# Altium schematic sheet Sheet2.SchDoc
size A4; SheetNumber: 1; SheetTotal: 1
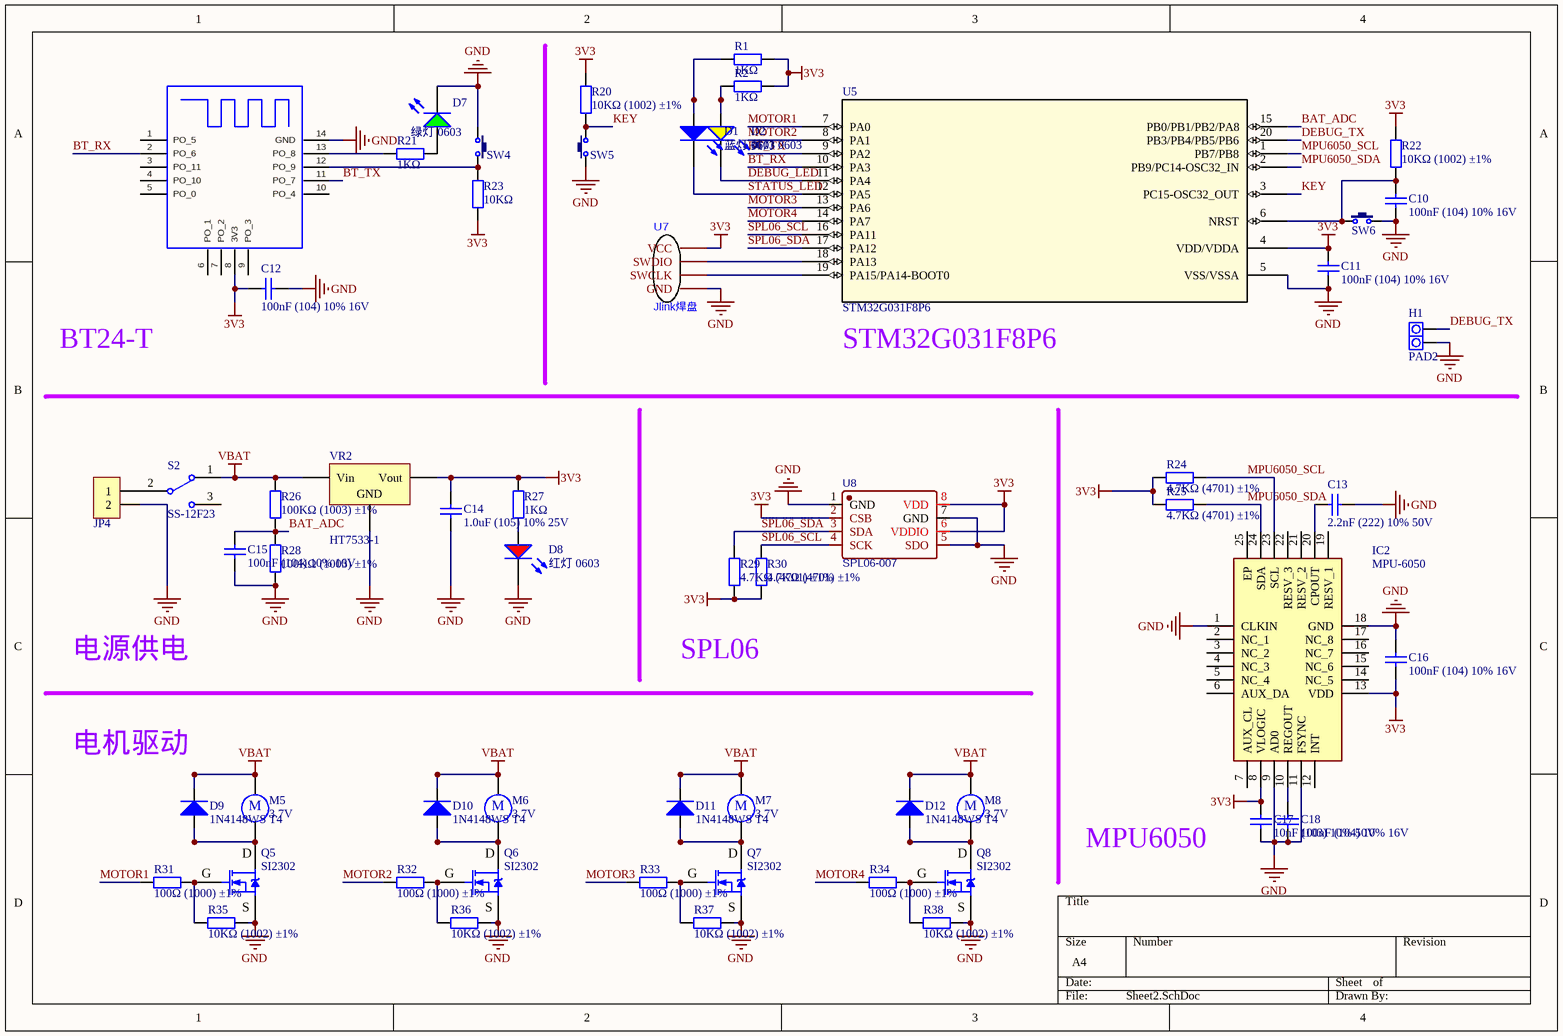
[diagram p0: Sheet2.SchDoc]

## Parts
C10  100nF (104) 10% 16V  [0402_C]
C11  100nF (104) 10% 16V  [0402_C]
C12  100nF (104) 10% 16V  [0402_C]
C13  2.2nF (222) 10% 50V  [0402_C]
C14  1.0uF (105) 10% 25V  [0402_C]
C15  100nF (104) 10% 16V  [0402_C]
C16  100nF (104) 10% 16V  [0402_C]
C17  10nF (103) 10% 50V  [0402_C]
C18  100nF (104) 10% 16V  [0402_C]
D1  蓝灯 0603  [0603_LED_S1]
D2  黄灯 0603  [0603_LED_S1]
D7  绿灯 0603  [0603_LED_S1]
D8  红灯 0603  [0603_LED_S1]
D9  1N4148WS T4  [SOD-323]
D10  1N4148WS T4  [SOD-323]
D11  1N4148WS T4  [SOD-323]
D12  1N4148WS T4  [SOD-323]
H1  PAD2  [PAD2-2.54]
IC2  MPU-6050  [MPU6050]
JP4  HDR-1X2  [ZH1.5-WI-2P]  (value not drawn)
M5  3.7V  [MX 1.25-WI-2P]
M6  3.7V  [MX 1.25-WI-2P]
M7  3.7V  [MX 1.25-WI-2P]
M8  3.7V  [MX 1.25-WI-2P]
Q5  SI2302  [SOT23-3N]
Q6  SI2302  [SOT23-3N]
Q7  SI2302  [SOT23-3N]
Q8  SI2302  [SOT23-3N]
R1  1KΩ  [0402_R]
R2  1KΩ  [0402_R]
R20  10KΩ (1002) ±1%  [0402_R]
R21  1KΩ  [0402_R]
R22  10KΩ (1002) ±1%  [0402_R]
R23  10KΩ  [0402_R]
R24  4.7KΩ (4701) ±1%  [0402_R]
R25  4.7KΩ (4701) ±1%  [0402_R]
R26  100KΩ (1003) ±1%  [0402_R]
R27  1KΩ  [0402_R]
R28  100KΩ (1003) ±1%  [0402_R]
R29  4.7KΩ (4701) ±1%  [0402_R]
R30  4.7KΩ (4701) ±1%  [0402_R]
R31  100Ω (1000) ±1%  [0402_R]
R32  100Ω (1000) ±1%  [0402_R]
R33  100Ω (1000) ±1%  [0402_R]
R34  100Ω (1000) ±1%  [0402_R]
R35  10KΩ (1002) ±1%  [0402_R]
R36  10KΩ (1002) ±1%  [0402_R]
R37  10KΩ (1002) ±1%  [0402_R]
R38  10KΩ (1002) ±1%  [0402_R]
S2  SS-12F23  [MSK-12C01-07]
SW4  3x6x5  [SW-SMD_4P-L5.1-W5.1-P3.70-LS6.5-TL-2]  (value not drawn)
SW5  3x6x5  [SW-SMD_4P-L5.1-W5.1-P3.70-LS6.5-TL-2]  (value not drawn)
SW6  3x6x5  [SW-SMD_4P-L5.1-W5.1-P3.70-LS6.5-TL-2]  (value not drawn)
U5  STM32G031F8P6  [TSSOP20]
U6  BT24T  [CC2640T]  (value not drawn)
U7  Jlink焊盘  [PCBComponent_1 - duplicate]
U8  SPL06-007  [SENSOR-SMD_SPL06-007]
VR2  HT7533-1  [SOT-89(SOT-89-3)]

## Nets
3V3: C11.1 C12.2 C14.2 C16.1 C17.2 IC2.8(VLOGIC) IC2.13(VDD) R1.2 R2.1 R20.2 R22.1 R23.2 R24.1 R25.1 R27.2 R29.1 R30.1 U5.4(VDD/VDDA) U6.8(3V3) U7.1(VCC) U8.2(CSB) U8.6(VDDIO) U8.8(VDD) VR2.3(Vout)
GND: C10.2 C11.2 C12.1 C13.2 C14.1 C15.1 C16.2 C17.1 C18.1 D7.K D8.K H1.1 IC2.1(CLKIN) IC2.9(AD0) IC2.11(FSYNC) IC2.18(GND) JP4.2 Q5.2(S) Q6.2(S) Q7.2(S) Q8.2(S) R28.1 R35.2 R36.2 R37.2 R38.2 SW4.1 SW5.1 SW6.2 U5.5(VSS/VSSA) U6.14(GND) U7.4(GND) U8.1(GND) U8.5(SDO) U8.7(GND) VR2.1(GND)
VBAT: D9.2(K) D10.2(K) D11.2(K) D12.2(K) M5.1 M6.1 M7.1 M8.1 R26.2 S2.1 VR2.2(Vin)
BAT_ADC: C15.2 R26.1 R28.2 U5.15(PB0/PB1/PB2/PA8)
BT_RX: U5.10(PA3) U6.2(PO_6)
BT_TX: U5.9(PA2) U6.11(PO_7)
DEBUG_LED: D2.K U5.11(PA4)
DEBUG_TX: H1.2 U5.20(PB3/PB4/PB5/PB6)
KEY: R20.1 SW5.2 U5.3(PC15-OSC32_OUT)
MOTOR1: R31.1 U5.7(PA0)
MOTOR2: R32.1 U5.8(PA1)
MOTOR3: R33.1 U5.13(PA6)
MOTOR4: R34.1 U5.14(PA7)
MPU6050_SCL: IC2.23(SCL) R24.2 U5.1(PB7/PB8)
MPU6050_SDA: IC2.24(SDA) R25.2 U5.2(PB9/PC14-OSC32_IN)
SPL06_SCL: R30.2 U5.16(PA11) U8.4(SCK)
SPL06_SDA: R29.2 U5.17(PA12) U8.3(SDA)
STATUS_LED: D1.K U5.12(PA5)
NetC10_1: C10.1 R22.2 SW6.1 U5.6(NRST)
NetC13_1: C13.1 IC2.20(CPOUT)
NetC18_2: C18.2 IC2.10(REGOUT)
NetD1_A: D1.A R1.1
NetD2_A: D2.A R2.2
NetD7_A: D7.A R21.2
NetD8_A: D8.A R27.1
NetD9_1: D9.1(A) M5.2 Q5.3(D)
NetD10_1: D10.1(A) M6.2 Q6.3(D)
NetD11_1: D11.1(A) M7.2 Q7.3(D)
NetD12_1: D12.1(A) M8.2 Q8.3(D)
NetJP4_1: JP4.1 S2.2
NetQ5_1: Q5.1(G) R31.2 R35.1
NetQ6_1: Q6.1(G) R32.2 R36.1
NetQ7_1: Q7.1(G) R33.2 R37.1
NetQ8_1: Q8.1(G) R34.2 R38.1
NetR21_1: R21.1 U6.13(PO_8)
NetR23_1: R23.1 SW4.2 U6.12(PO_9)
NetU5_18: U5.18(PA13) U7.2(SWDIO)
NetU5_19: U5.19(PA15/PA14-BOOT0) U7.3(SWCLK)

Not connected (* = marked no-connect by the designer): IC2 2(NC_1) 3(NC_2) 4(NC_3) 5(NC_4) 6(AUX_DA) 7(AUX_CL) 12(INT) 14(NC_5) 15(NC_6) 16(NC_7) 17(NC_8) 19(RESV_1) 21(RESV_2) 22(RESV_3) 25(EP); S2 3; U6 1(PO_5) 3(PO_11) 4(PO_10) 5(PO_0) 6(PO_1) 7(PO_2) 9(PO_3) 10(PO_4)

## Notes on the sheet
- BT24-T
- (near U5) STM32G031F8P6
- 电源供电
- SPL06
- 电机驱动
- MPU6050
- (in symbol MOTOR) M

## Library data of the parts
C10-C12 C15 C16 C18 = 0402 100nF (104) 10% 16V: 贴片电容; ComponentLink1Description: 供应商链接; ComponentLink1URL: http://www.szlcsc.com/product/details_1877.html; Package: 0402; Supplier: LC; SuppliersPartNumber: C1525
C13 = 0402 2.2nF (222) 10% 50V: 贴片电容; ComponentLink1Description: 供应商链接; ComponentLink1URL: http://www.szlcsc.com/product/details_1883.html; Package: 0402; Supplier: LC; SuppliersPartNumber: C1531
C14 = 0402 1.0uF (105) 10% 25V: 贴片电容; ComponentLink1Description: 供应商链接; ComponentLink1URL: http://www.szlcsc.com/product/details_53938.html; Package: 0402; Supplier: LC; SuppliersPartNumber: C52923
C17 = 0402 10nF (103) 10% 50V: 贴片电容; ComponentLink1Description: 供应商链接; ComponentLink1URL: http://www.szlcsc.com/product/details_15869.html; Package: 0402; Supplier: LC; SuppliersPartNumber: C15195
D1 = 0603 蓝灯: 发光二极管; ComponentLink1Description: 供应商链接; ComponentLink1URL: http://www.szlcsc.com/product/details_73150.html; Package: 0603; Supplier: LC; SuppliersPartNumber: C72041
D2 = 0603 黄灯: 发光二极管; ComponentLink1Description: 供应商链接; ComponentLink1URL: http://www.szlcsc.com/product/details_73147.html; Package: 0603; Supplier: LC; SuppliersPartNumber: C72038
D7 = 0603 绿灯: 发光二极管; ComponentLink1Description: 供应商链接; ComponentLink1URL: http://www.szlcsc.com/product/details_73152.html; Package: 0603; Supplier: LC; SuppliersPartNumber: C72043
D8 = 0603 红灯: 发光二极管; ComponentLink1Description: 供应商链接; ComponentLink1URL: http://www.szlcsc.com/product/details_2659.html; Package: 0603; Supplier: LC; SuppliersPartNumber: C2286
D9-D12 = SOD-323 1N4148WS T4: 二极管; ComponentLink1Description: 供应商链接; ComponentLink1URL: http://www.szlcsc.com/product/details_2485.html; Package: SOD-323; Supplier: LC; SuppliersPartNumber: C2128
H1 = PAD2: 引线焊盘; 版权归属: 源创客; BOM名称: 引线焊盘; 学习资源: www.ooocke.com
IC2 = MPU-6050: Integrated Circuit; Manufacturer_Name: TDK; Datasheet Link: https://invensense.tdk.com/wp-content/uploads/2015/02/MPU-6000-Datasheet1.pdf; Height: 0.95mm; Manufacturer_Part_Number: MPU-6050; Mouser Part Number: 410-MPU-6050; Mouser Price/Stock: https://www.mouser.co.uk/ProductDetail/TDK-InvenSense/MPU-6050?qs=u4fy%2FsgLU9O14B5JgyQFvg%3D%3D; Arrow Part Number: MPU-6050; Arrow Price/Stock: https://www.arrow.com/en/products/mpu-6050/invensense?region=nac
JP4 = Header 2: 2P接插件; 版权归属: 源创客; BOM名称: 2P接插件; 学习资源: www.ooocke.com
M5-M8 = MOTOR: 直流电机; 版权归属: 源创客; BOM名称: 直流电机; 学习资源: www.ooocke.com
Q5-Q8 = SI2302: N沟道场效应管; 版权归属: 源创客; BOM名称: N沟道场效应管; 学习资源: www.ooocke.com
R1 R2 R21 R27 = 0402 1KΩ (1001) 1%: 贴片电阻; ComponentLink1Description: 供应商链接; ComponentLink1URL: http://www.szlcsc.com/product/details_12256.html; Package: 0402; Supplier: LC; SuppliersPartNumber: C11702
R20 R22 R23 R35-R38 = 0402 10KΩ (1002) 1%: 贴片电阻; ComponentLink1Description: 供应商链接; ComponentLink1URL: http://www.szlcsc.com/product/details_26487.html; Package: 0402; Supplier: LC; SuppliersPartNumber: C25744
R24 R25 R29 R30 = 0402 4.7KΩ (4701) 1%: 贴片电阻; ComponentLink1Description: 供应商链接; ComponentLink1URL: http://www.szlcsc.com/product/details_26643.html; Package: 0402; Supplier: LC; SuppliersPartNumber: C25900
R26 R28 = 0402 100KΩ (1003) 1%: 贴片电阻; ComponentLink1Description: 供应商链接; ComponentLink1URL: http://www.szlcsc.com/product/details_26484.html; Package: 0402; Supplier: LC; SuppliersPartNumber: C25741
R31-R34 = 0402 100Ω (1000) 1%: 贴片电阻; ComponentLink1Description: 供应商链接; ComponentLink1URL: http://www.szlcsc.com/product/details_25819.html; Package: 0402; Supplier: LC; SuppliersPartNumber: C25076
S2 = SSW-1P: 1路波动开关; BOM名称: 波动开关; 版权归属: 源创客; 学习资源: www.ooocke.com
SW4-SW6 = TSW 3x6: 3x6轻触开关; pin to pad: 1>1+2 2>3+4; 版权归属: 源创客; BOM名称: 3x6轻触开关; 学习资源: www.ooocke.com
U5 = STM32G031F8P6: No Description Available; Mfr_Name: STMicroelectronics; Copyright: Copyright (C) 2022 Ultra Librarian. All rights reserved.; Manufacturer_Part_Number: STM32G031F8P6; RefDes: RefDes; Type: DEV
U6 = BT24T: PCB DECAL: BT04-E01
U8 = SPL06-007: BOM_Manufacturer: Goertek; Contributor: LCSC; BOM_Supplier: LCSC; BOM_Supplier Part: C233787; BOM_Manufacturer Part: SPL06-007; BOM_JLCPCB Part Class: Extended Part; spicePre: U; spiceSymbolName: SPL06-007
VR2 = SOT-89 HT7533-1: 低压差线性稳压(LDO); ComponentLink1Description: 供应商链接; ComponentLink1URL: http://www.szlcsc.com/product/details_14949.html; Package: SOT-89; Supplier: LC; SuppliersPartNumber: C14289